# Altium project MCU103A.PrjPcb (part 1 of 4)
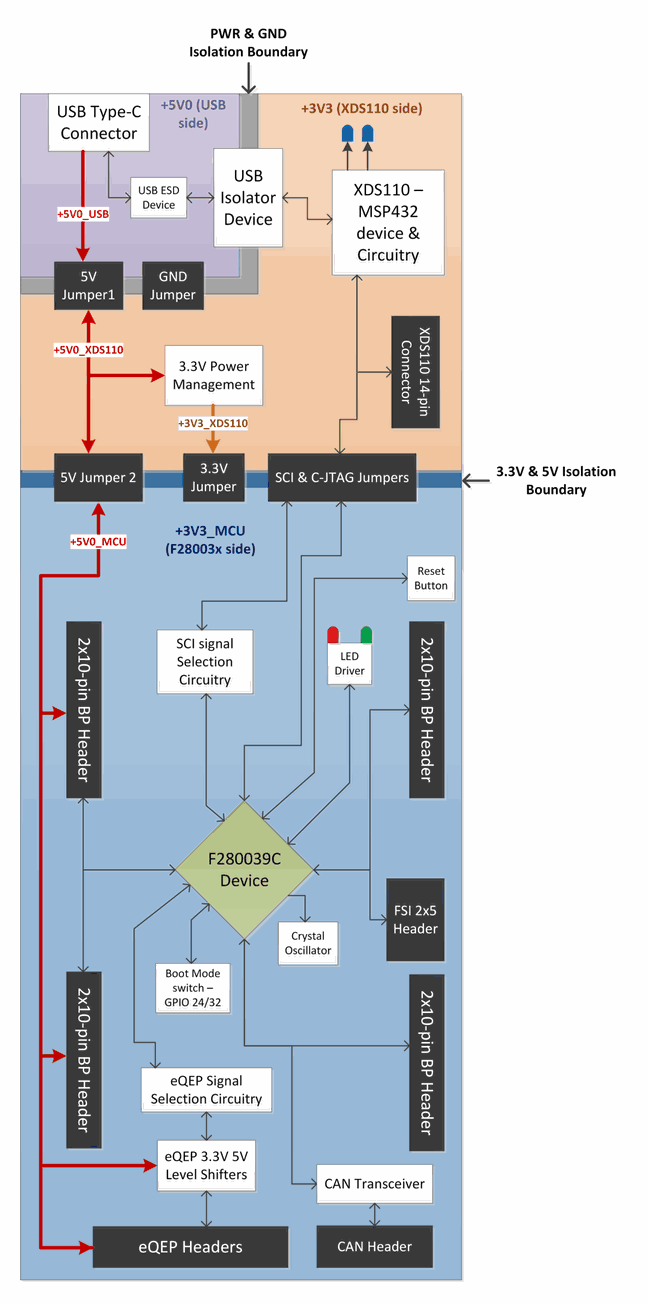
[diagram p0: MCU103A_Block_Diagram.SchDoc]
CopyrightYear: 2021; EVM_orderable: LAUNCHXL-F280039C; PCB_Layout: a0232540; PCB_Rev: A; PRJ_Customer: Public Release; PRJ_Engineer: Kevin Allen; PRJ_Number: MCU103; PRJ_Title: LAUNCHXL-F280039C; SCH_Rev: A; TechSupport: http://www.ti.com/support; TID: N/A
8 sheets, 257 parts. Net scope: global (net labels, ports and power ports of the same name join across sheets).
Board file: MCU103A.PcbDoc
Sheets:
  MCU103A_Block_Diagram.SchDoc
  MCU103A_Connectors.SchDoc
  MCU103A_AltRouting_Misc.SchDoc
  MCU103A_F280039C_Device.SchDoc
  MCU103A_F2800137_Device.SchDoc
  MCU103A_USB_and_Power.SchDoc
  MCU103A_XDS110_MCU.SchDoc
  MCU103A_Hardware.SchDoc

## Sheet MCU103A_Block_Diagram.SchDoc
size 431 x 279 mm; Date: Not shown in title block; ApprovedBy: Not shown in title block; CheckedBy: Not shown in title block; Author: Not shown in title block; CompanyName: Not shown in title block; Engineer: Not shown in title block; Organization: Not shown in title block; Address1: Not shown in title block; Address2: Not shown in title block; Address3: Not shown in title block; Address4: Not shown in title block; DocumentNumber: 1; Revision: Use project parameter SCH_Rev; SheetNumber: 1; SheetTotal: 8; PageSetup: Record=PageOptions|CenterHorizontal=True|CenterVertical=True|PrintScale=1.00|XCorrection=1.00|YCorrection=1.00|PrintKind=0|BorderSize=5000000|LeftOffset=0|BottomOffset=0|Orientation=2|PaperLength=1000|PaperWidth=1000|Scale=100|PaperSource=15|PrintQuality=600|MediaType=1|DitherType=10|PaperKind=Letter|PrintScaleMode=1; CurrentTime: Not shown in title block; CurrentDate: Not shown in title block; Time: Not shown in title block; DocumentFullPathAndName: Not shown in title block; DocumentName: Not shown in title block; ModifiedDate: Not shown in title block; ImagePath: Not shown in title block

### Notes on the sheet
- Drawn By:
- SVN Rev:
- Number:
- TID #:
- Orderable:
- Rev:
- Sheet Title:
- File:
- Project Title:
- Designed for:
- Assembly Variant:
- Mod. Date:
- Sheet:
- Size:
- of
- B
- http://www.ti.com
- Texas Instruments and/or its licensors do not warrant the accuracy or completeness of this specification or any information contained therein. Texas Instruments and/or its licensors do not warrant that this design will meet the specifications, will be suitable for your application or fit for any particular purpose, or will operate in an implementation. Texas Instruments and/or its licensors do not warrant that the design is production worthy. You should completely validate and test your design implementation to confirm the system functionality for your application.
- Engineer:
- Contact:
- © Texas Instruments

## Sheet MCU103A_Connectors.SchDoc
size 431 x 279 mm; Date: Not shown in title block; ApprovedBy: Not shown in title block; CheckedBy: Not shown in title block; Author: Not shown in title block; CompanyName: Not shown in title block; Engineer: Not shown in title block; Organization: Not shown in title block; Address1: Not shown in title block; Address2: Not shown in title block; Address3: Not shown in title block; Address4: Not shown in title block; DocumentNumber: 2; Revision: Use project parameter SCH_Rev; SheetNumber: 2; SheetTotal: 8; PageSetup: Record=PageOptions|CenterHorizontal=True|CenterVertical=True|PrintScale=1.00|XCorrection=1.00|YCorrection=1.00|PrintKind=0|BorderSize=5000000|LeftOffset=0|BottomOffset=0|Orientation=2|PaperLength=1000|PaperWidth=1000|Scale=100|PaperSource=15|PrintQuality=600|MediaType=1|DitherType=10|PaperKind=Letter|PrintScaleMode=1; CurrentTime: Not shown in title block; CurrentDate: Not shown in title block; Time: Not shown in title block; DocumentFullPathAndName: Not shown in title block; DocumentName: Not shown in title block; ModifiedDate: Not shown in title block; ImagePath: Not shown in title block
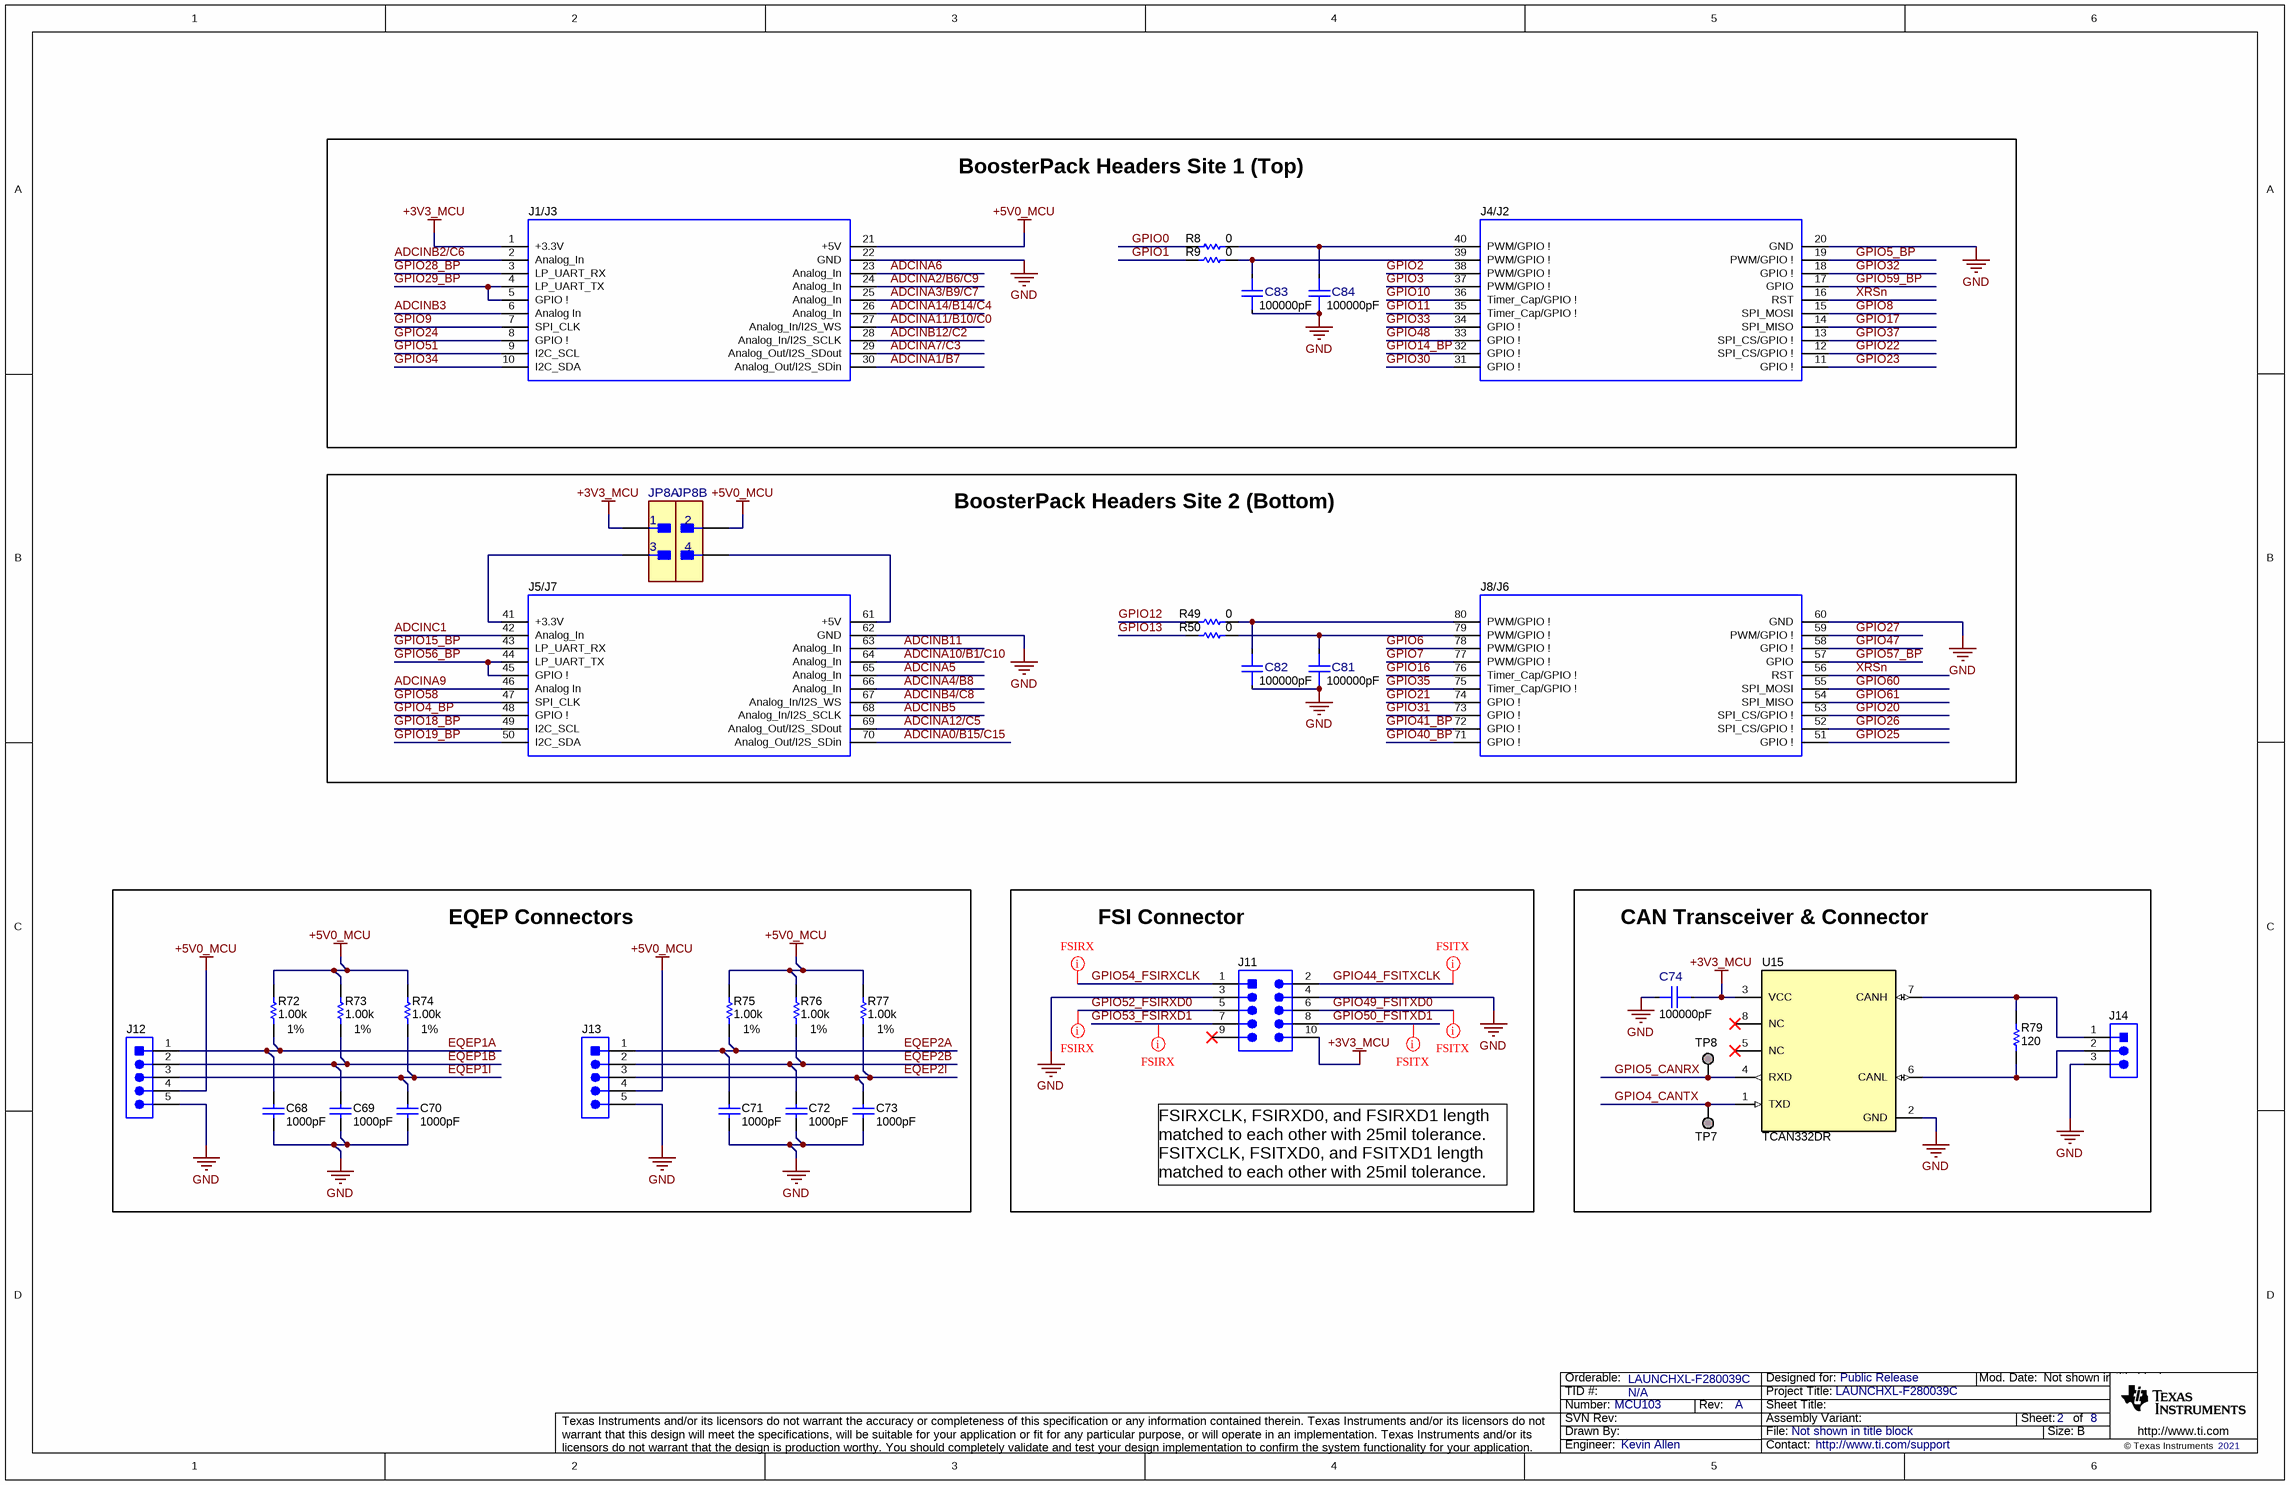
[diagram p1: MCU103A_Connectors.SchDoc]

### Parts
C68  ValueDisplayed: 1000pF  [0402]  (hidden comment: 885012205061)
C69  ValueDisplayed: 1000pF  [0402]  (hidden comment: 885012205061)
C70  ValueDisplayed: 1000pF  [0402]  (hidden comment: 885012205061)
C71  ValueDisplayed: 1000pF  [0402]  (hidden comment: 885012205061)
C72  ValueDisplayed: 1000pF  [0402]  (hidden comment: 885012205061)
C73  ValueDisplayed: 1000pF  [0402]  (hidden comment: 885012205061)
C74  ValueDisplayed: 100000pF  [FP-885012205018_0402-MFG]  (hidden comment: 885012205018)
C81  ValueDisplayed: 100000pF  [FP-885012205018_0402-MFG]  (hidden comment: 885012205018)
C82  ValueDisplayed: 100000pF  [FP-885012205018_0402-MFG]  (hidden comment: 885012205018)
C83  ValueDisplayed: 100000pF  [FP-885012205018_0402-MFG]  (hidden comment: 885012205018)
C84  ValueDisplayed: 100000pF  [FP-885012205018_0402-MFG]  (hidden comment: 885012205018)
J1/J3  SSQ-110-03-T-D  [BoosterPack_40pin_J1J3]  (value not drawn)
J4/J2  SSQ-110-03-T-D  [BoosterPack_40pin_J2J4]  (value not drawn)
J5/J7  SSQ-110-03-T-D  [BoosterPack_40pin_J5J7]  (value not drawn)
J8/J6  SSQ-110-03-T-D  [BoosterPack_40pin_J6J8]  (value not drawn)
J11  61301021121  [WURTH_61301021121]  (value not drawn)
J12  61300511121  [Wurth_61300511121]  (value not drawn)
J13  61300511121  [Wurth_61300511121]  (value not drawn)
J14  61300311121  [WURTH_61300311121]  (value not drawn)
JP8  61300421121  [FP-61300421121_HDR4-MFG]  (value not drawn)  (parts A,B of 2)
R8  ValueDisplayed: 0  [0402]  (hidden comment: RC0402JR-070RL)
R9  ValueDisplayed: 0  [0402]  (hidden comment: RC0402JR-070RL)
R49  ValueDisplayed: 0  [0402]  (hidden comment: RC0402JR-070RL)
R50  ValueDisplayed: 0  [0402]  (hidden comment: RC0402JR-070RL)
R72  ValueDisplayed: 1.00k  Value1: 1%  [0402]  (hidden comment: CRCW04021K00FKED)
R73  ValueDisplayed: 1.00k  Value1: 1%  [0402]  (hidden comment: CRCW04021K00FKED)
R74  ValueDisplayed: 1.00k  Value1: 1%  [0402]  (hidden comment: CRCW04021K00FKED)
R75  ValueDisplayed: 1.00k  Value1: 1%  [0402]  (hidden comment: CRCW04021K00FKED)
R76  ValueDisplayed: 1.00k  Value1: 1%  [0402]  (hidden comment: CRCW04021K00FKED)
R77  ValueDisplayed: 1.00k  Value1: 1%  [0402]  (hidden comment: CRCW04021K00FKED)
R79  ValueDisplayed: 120  [0603]  (hidden comment: RC0603FR-07120RL)
TP7  TESTPOINT  [TP_50MIL-25MILHOLE]  (value not drawn)  (no BOM)
TP8  TESTPOINT  [TP_50MIL-25MILHOLE]  (value not drawn)  (no BOM)
U15  TCAN332DR  [D0008A_N]

### Blocks framed on the sheet
BoosterPack Headers Site 1 (Top): C83 C84 J1/J3 J4/J2 R8 R9
BoosterPack Headers Site 2 (Bottom): C81 C82 J5/J7 J8/J6 JP8 R49 R50
EQEP Connectors: C68-C73 J12 J13 R72-R77
FSI Connector: J11
CAN Transceiver & Connector: C74 J14 R79 TP7 TP8 U15

### Nets
+3V3_MCU: C74.1 J1/J3.1(+3.3V) J11.10 JP8.1 U15.3(VCC)
+5V0_MCU: J1/J3.21(+5V) J12.4 J13.4 JP8.2 R72.2 R73.2 R74.2 R75.2 R76.2 R77.2
GND: C68.2 C69.2 C70.2 C71.2 C72.2 C73.2 C74.2 C81.1 C82.1 C83.1 C84.1 J1/J3.22(GND) J4/J2.20(GND) J5/J7.62(GND) J8/J6.60(GND) J11.3 J11.4 J12.5 J13.5 J14.3 U15.2(GND)
ADCINA0/B15/C15: J5/J7.70(Analog_Out/I2S_SDin)
ADCINA1/B7: J1/J3.30(Analog_Out/I2S_SDin)
ADCINA2/B6/C9: J1/J3.24(Analog_In)
ADCINA3/B9/C7: J1/J3.25(Analog_In)
ADCINA4/B8: J5/J7.66(Analog_In)
ADCINA5: J5/J7.65(Analog_In)
ADCINA6: J1/J3.23(Analog_In)
ADCINA7/C3: J1/J3.29(Analog_Out/I2S_SDout)
ADCINA9: J5/J7.46(Analog_In)
ADCINA10/B1/C10: J5/J7.64(Analog_In)
ADCINA11/B10/C0: J1/J3.27(Analog_In/I2S_WS)
ADCINA12/C5: J5/J7.69(Analog_Out/I2S_SDout)
ADCINA14/B14/C4: J1/J3.26(Analog_In)
ADCINB2/C6: J1/J3.2(Analog_In)
ADCINB3: J1/J3.6(Analog_In)
ADCINB4/C8: J5/J7.67(Analog_In/I2S_WS)
ADCINB5: J5/J7.68(Analog_In/I2S_SCLK)
ADCINB11: J5/J7.63(Analog_In)
ADCINB12/C2: J1/J3.28(Analog_In/I2S_SCLK)
ADCINC1: J5/J7.42(Analog_In)
EQEP1A: C68.1 J12.1 R72.1
EQEP1B: C69.1 J12.2 R73.1
EQEP1I: C70.1 J12.3 R74.1
EQEP2A: C71.1 J13.1 R75.1
EQEP2B: C72.1 J13.2 R76.1
EQEP2I: C73.1 J13.3 R77.1
GPIO0: R8.1
GPIO1: R9.1
GPIO2: J4/J2.38(PWM/GPIO_!)
GPIO3: J4/J2.37(PWM/GPIO_!)
GPIO4_BP: J5/J7.48(GPIO_!)
GPIO4_CANTX: TP7.1 U15.1(TXD)
GPIO5_BP: J4/J2.19(PWM/GPIO_!)
GPIO5_CANRX: TP8.1 U15.4(RXD)
GPIO6: J8/J6.78(PWM/GPIO_!)
GPIO7: J8/J6.77(PWM/GPIO_!)
GPIO8: J4/J2.15(SPI_MOSI)
GPIO9: J1/J3.7(SPI_CLK)
GPIO10: J4/J2.36(Timer_Cap/GPIO_!)
GPIO11: J4/J2.35(Timer_Cap/GPIO_!)
GPIO12: R49.1
GPIO13: R50.1
GPIO14_BP: J4/J2.32(GPIO_!)
GPIO15_BP: J5/J7.43(LP_UART_RX)
GPIO16: J8/J6.76(Timer_Cap/GPIO_!)
GPIO17: J4/J2.14(SPI_MISO)
GPIO18_BP: J5/J7.49(I2C_SCL)
GPIO19_BP: J5/J7.50(I2C_SDA)
GPIO20: J8/J6.53(SPI_CS/GPIO_!)
GPIO21: J8/J6.74(GPIO_!)
GPIO22: J4/J2.12(SPI_CS/GPIO_!)
GPIO23: J4/J2.11(GPIO_!)
GPIO24: J1/J3.8(GPIO_!)
GPIO25: J8/J6.51(GPIO_!)
GPIO26: J8/J6.52(SPI_CS/GPIO_!)
GPIO27: J8/J6.59(PWM/GPIO_!)
GPIO28_BP: J1/J3.3(LP_UART_RX)
GPIO29_BP: J1/J3.4(LP_UART_TX) J1/J3.5(GPIO_!)
GPIO30: J4/J2.31(GPIO_!)
GPIO31: J8/J6.73(GPIO_!)
GPIO32: J4/J2.18(GPIO_!)
GPIO33: J4/J2.34(GPIO_!)
GPIO34: J1/J3.10(I2C_SDA)
GPIO35: J8/J6.75(Timer_Cap/GPIO_!)
GPIO37: J4/J2.13(SPI_CS/GPIO_!)
GPIO40_BP: J8/J6.71(GPIO_!)
GPIO41_BP: J8/J6.72(GPIO_!)
GPIO44_FSITXCLK: J11.2
GPIO47: J8/J6.58(GPIO_!)
GPIO48: J4/J2.33(GPIO_!)
GPIO49_FSITXD0: J11.6
GPIO50_FSITXD1: J11.8
GPIO51: J1/J3.9(I2C_SCL)
GPIO52_FSIRXD0: J11.5
GPIO53_FSIRXD1: J11.7
GPIO54_FSIRXCLK: J11.1
GPIO56_BP: J5/J7.44(LP_UART_TX) J5/J7.45(GPIO_!)
GPIO57_BP: J8/J6.57(GPIO)
GPIO58: J5/J7.47(SPI_CLK)
GPIO59_BP: J4/J2.17(GPIO)
GPIO60: J8/J6.55(SPI_MOSI)
GPIO61: J8/J6.54(SPI_MISO)
XRSn: J4/J2.16(RST) J8/J6.56(RST)
NetC81_2: C81.2 J8/J6.79(PWM/GPIO_!) R50.2
NetC82_2: C82.2 J8/J6.80(PWM/GPIO_!) R49.2
NetC83_2: C83.2 J4/J2.39(PWM/GPIO_!) R9.2
NetC84_2: C84.2 J4/J2.40(PWM/GPIO_!) R8.2
NetJ5/J7_41: J5/J7.41(+3.3V) JP8.3
NetJ5/J7_61: J5/J7.61(+5V) JP8.4
NetJ14_1: J14.1 R79.2 U15.7(CANH)
NetJ14_2: J14.2 R79.1 U15.6(CANL)

Not connected (* = marked no-connect by the designer): J11 9*; U15 5(NC)* 8(NC)*

### Layout directives
net class FSIRX: GPIO52_FSIRXD0, GPIO53_FSIRXD1, GPIO54_FSIRXCLK
net class FSITX: GPIO44_FSITXCLK, GPIO49_FSITXD0, GPIO50_FSITXD1

### Notes on the sheet
- FSIRXCLK, FSIRXD0, and FSIRXD1 length matched to each other with 25mil tolerance.
  FSITXCLK, FSITXD0, and FSITXD1 length matched to each other with 25mil tolerance.
- Drawn By:
- SVN Rev:
- Number:
- TID #:
- Orderable:
- Rev:
- Sheet Title:
- File:
- Project Title:
- Designed for:
- Assembly Variant:
- Mod. Date:
- Sheet:
- Size:
- of
- B
- http://www.ti.com
- Texas Instruments and/or its licensors do not warrant the accuracy or completeness of this specification or any information contained therein. Texas Instruments and/or its licensors do not warrant that this design will meet the specifications, will be suitable for your application or fit for any particular purpose, or will operate in an implementation. Texas Instruments and/or its licensors do not warrant that the design is production worthy. You should completely validate and test your design implementation to confirm the system functionality for your application.
- Engineer:
- Contact:
- © Texas Instruments

### Library data of the parts
C68-C73 = CMP-0006231-2: CAP, CERM, 1000 pF, 50 V, +/- 10%, X7R, 0402; Manufacturer: Wurth Elektronik; Polarized: N; Value: 1000pF; U/M: EA; Cap_F: 1nF; Value1: Unknown; VDC_V: 50V; TaMin_C: -55°C; TaMax_C: 125°C; SizeArea_mm2: 0.5; SizeAreaWB_mm2: 3; SizeX_mm: 1; SizeZ_mm: 0.6; AEC Category: Q200; CompType: Capacitor; PartNumber: 885012205061; PackageReference: 0402; RoHS: Y; Tolerance_%: 10%; Value2: 50V; MountType: SMT; Technology: Ceramic; TempCo: X7R; Cap_Case: 0402; SizeY_mm: 0.5; Published: 2008-06-19; Publisher: Texas Instruments; LatestRevisionDate: 2017-03-09; ComponentLink1Description: Datasheet link; ComponentLink1URL: http://katalog.we-online.de/pbs/datasheet/885012205061.pdf; Supplier 1: Digi-Key; Supplier Part Number 1: 732-7556-1-ND; Supplier 2: Mouser; Supplier Part Number 2: 710-885012205061; AEC Qualified: N; AEC Grade: N/A
C74 C81-C84 = CMP-0090362-1: 0.1µF ±10% 10V Ceramic Capacitor X7R 0402 (1005 Metric); Manufacturer: Wurth Electronics; AEC Qualified: No; Value: 100nF; SizeZ_mm: 0.55mm; TempCo: 15%; RoHS: TRUE; Tolerance_%: 10%; datasheet: https://www.we-online.com/catalog/datasheet/885012205018.pdf; Lead Free: Yes; Operating Temperature Range: -55°C to +125°C; ComponentLink1Description: Datasheet; Digikey Description: CAP CER 0.1UF 10V X7R 0402; Supplier Part Number 1: 732-7513-1-ND; Supplier 2: Mouser; Mouser Part Number: 710-885012205018; Digikey Part Number: 732-7513-1-ND; Temperature Characteristic: X7R; Supplier 1: Digikey; Datasheet Path: datasheets/Cap-885012205018.pdf; ComponentLink1URL: https://www.we-online.com/catalog/datasheet/885012205018.pdf; VDC_V: 10V; Supplier Part Number 2: 710-885012205018; Cap_F: 100nF; PackageReference: 0402; PartNumber: 885012205018; Part Number: 885012205018; helpURL: https://upverter.com/upn/revision/1acbe355db19639d/
J1/J3 = CMP-0003837-4: Receptacle, 2.54mm, 10x2, Tin, TH; Alternate PartNumber: CRD-081413-A-G; Manufacturer: Samtec; Alternate Manufacturer: Major League Electronics; Note: Booster Pack 40 pin J1 and J3; Green_Lifecycle: Active; Green_REACh: Incomplete; Supplier 1: Digi-Key; CompType: Receptacle; PackageReference: 10x2 Receptacle; RoHS: Y; Supplier Part Number 1: SAM1204-10-ND; MountType: TH; PartNumber: SSQ-110-03-T-D; ComponentLink1Description: Datasheet Link; ComponentLink1URL: https://www.samtec.com/ftppub/cpdf/SSQ-1XX-XX-XXX-X-XX-XXX-XX-X-MKT.pdf; Supplier 2: Newark; Supplier Part Number 2: 11P8392; Green_EU RoHS: Passed; Green_EU RoHS-2: Passed
J4/J2 = CMP-0078266-4: Receptacle, 2.54mm, 10x2, Tin, TH; Alternate PartNumber: CRD-081413-A-G; Manufacturer: Samtec; Alternate Manufacturer: Major League Electronics; Note: Booster Pack 40 pin J2 and J4; Green_REACh: Incomplete; Green_Lifecycle: Active; Green_EU RoHS-2: Passed; CompType: Receptacle; Supplier 1: Digi-Key; PackageReference: 10x2 Receptacle; RoHS: Y; Supplier Part Number 1: SAM1204-10-ND; PartNumber: SSQ-110-03-T-D; MountType: TH; ComponentLink1Description: Datasheet Link; Green_EU RoHS: Passed; ComponentLink1URL: https://www.samtec.com/ftppub/cpdf/SSQ-1XX-XX-XXX-X-XX-XXX-XX-X-MKT.pdf; Supplier 2: Newark; Supplier Part Number 2: 11P8392
J5/J7 = CMP-0081070-3: Receptacle, 2.54mm, 10x2, Tin, TH; Alternate PartNumber: CRD-081413-A-G; Manufacturer: Samtec; Alternate Manufacturer: Major League Electronics; Note: Booster Pack 40 pin J5 and J7; Green_REACh: Incomplete; Green_Lifecycle: Active; ComponentLink1URL: https://www.samtec.com/ftppub/cpdf/SSQ-1XX-XX-XXX-X-XX-XXX-XX-X-MKT.pdf; Green_EU RoHS-2: Passed; CompType: Receptacle; Supplier 1: Digi-Key; PackageReference: 10x2 Receptacle; RoHS: Y; Supplier Part Number 1: SAM1204-10-ND; PartNumber: SSQ-110-03-T-D; MountType: TH; ComponentLink1Description: Datasheet Link; Green_EU RoHS: Passed
J8/J6 = CMP-0081071-3: Receptacle, 2.54mm, 10x2, Tin, TH; Alternate PartNumber: CRD-081413-A-G; Manufacturer: Samtec; Alternate Manufacturer: Major League Electronics; Note: Booster Pack 40 pin J6 and J8; Green_REACh: Incomplete; Green_Lifecycle: Active; ComponentLink1URL: https://www.samtec.com/ftppub/cpdf/SSQ-1XX-XX-XXX-X-XX-XXX-XX-X-MKT.pdf; Green_EU RoHS-2: Passed; CompType: Receptacle; Supplier 1: Digi-Key; PackageReference: 10x2 Receptacle; RoHS: Y; Supplier Part Number 1: SAM1204-10-ND; PartNumber: SSQ-110-03-T-D; MountType: TH; ComponentLink1Description: Datasheet Link; Green_EU RoHS: Passed
J11 = CMP-0054806-3: Header, 2.54 mm, 5x2, Gold, TH; Manufacturer: Wurth Elektronik; Green_Lifecycle: Active; Green_REACh: Passed; Cert_UL: Y; Current_A: 3A; Gender: Male; Pitch_mm: 2.54; Row_Count: 2; Shrouded: N; Voltage_V: 250V; ComponentLink1URL: http://katalog.we-online.de/em/datasheet/6130xx21121.pdf; ClassName: Header; Supplier Part Number 2: 16T0631; Supplier 2: Newark; Supplier Part Number 3: 710-61301021121; Supplier 3: Mouser; RoHS: Y; MountType: TH; Green_EU RoHS-2: Incomplete; Supplier 1: Digi-Key; Green_EU RoHS: Passed; PackageReference: Header, 2.54mm, 5x2, TH; CompType: Header; PartNumber: 61301021121; ComponentLink1Description: Datasheet URL; Supplier Part Number 1: 732-2672-ND; ContactFinish: Gold; Orientation: Vertical; PinCount: 10; RowSpacing_mm: 2.54
J12 J13 = CMP-0084909-1: Header, 2.54mm, 5x1, Gold, TH; Manufacturer: Wurth Elektronik; Pitch_mm: 2.54; Gender: Male; Row_Count: 1; Shrouded: N; Current_A: 3A; Voltage_V: 250V; Color: Black; PinCount: 5; ContactFinish: Gold; ComponentLink1URL: https://katalog.we-online.de/em/datasheet/6130xx11121.pdf; ComponentLink1Description: Datasheet URL; CompType: Header; MountType: TH; PartNumber: 61300511121; RoHS: Y; PackageReference: Header, 2.54mm, 5x1, TH; ClassName: Header; Orientation: Vertical
J14 = CMP-0054796-1: Header, 2.54 mm, 3x1, Gold, TH; Manufacturer: Wurth Elektronik; Green_Lifecycle: Active; Green_REACh: Passed; CNHeader: TRUE; CT: FALSE; PartNumber: 61300311121; PackageReference: Header, 2.54mm, 3x1, TH; ClassName: Header; CompType: Header; RoHS: Y; MountType: TH; ComponentLink1Description: Datasheet URL; ComponentLink1URL: http://katalog.we-online.de/em/datasheet/6130xx11121.pdf; Publisher: Texas Instruments; LatestRevisionDate: 26/05/2017; Supplier 1: Digi-Key; Supplier Part Number 1: 732-5316-ND; Supplier 2: Newark; Supplier Part Number 2: 20X0950; Supplier 3: Farnell; Supplier Part Number 3: 356154; Green_EU RoHS: Passed; Green_EU RoHS-2: Incomplete
JP8 = CMP-0092422-1: THT Vertical Pin Header WR-PHD, Pitch 2.54 mm, Dual Row, 4 pins; Manufacturer: Wurth Electronics; DUT-Pitch_mm: 2.54mm; SizeZ_mm: 8.89mm; Voltage_V: 250V; Conn Gender: Male; AEC Qualified: No; Row_Count: 2; ContactFinish: Gold; Conn Orientation: Straight; Current_A: 3A; Supplier Part Number 2: 710-61300421121; Supplier 1: Digikey; Mouser Part Number: 710-61300421121; Operating Temperature Range: -40°C to +105°C; ComponentLink1URL: https://www.we-online.com/catalog/datasheet/61300421121.pdf; Lead Free: Yes; PinCount: 4; Supplier Part Number 1: 732-5294-ND; Part Number: 61300421121; RoHS: TRUE; Digikey Part Number: 732-5294-ND; Is Female: no; Digikey Description: CONN HEADER VERT 4POS 2.54MM; datasheet: https://www.we-online.com/catalog/datasheet/61300421121.pdf; PartNumber: 61300421121; Supplier 2: Mouser; Datasheet Path: datasheets/Conn-61300421121.pdf; PackageReference: HDR4; helpURL: https://upverter.com/upn/revision/de171c811246619e/; ComponentLink1Description: Datasheet
R8 R9 R49 R50 = CMP-0027004-2: RES, 0, 5%, 0.063 W, 0402; Manufacturer: Yageo America; Power_W: 63mW; TempCo: 200 ppm/C; Value_Code: 0000; U/M: EA; Value: 0; EIA_Code: E24; SizeX_mm: 1; SizeY_mm: 0.5; SizeZ_mm: 0.6; Value2: 0.063W; VDC_V: 50V; AEC Category: Q200; Supplier Part Number 2: 603-RC0402JR-070RL; Publisher: Texas Instruments; Supplier 2: Mouser; Supplier Part Number 3: 9232516; Supplier 3: Farnell; Published: 2008-06-26; RoHS: Y; Value1: 5%; MountType: SMT; Supplier 1: Digi-Key; PackageReference: 0402; Tolerance_%: 5%; Res_ohm: 0; SizeArea_mm2: 0.5; CompType: Resistor; LatestRevisionDate: 2017-03-09; PartNumber: RC0402JR-070RL; AEC Qualified: ?; ComponentLink1Description: Datasheet link; Supplier Part Number 1: 311-0.0JRCT-ND; Technology: Thick Film; ComponentLink1URL: http://www.yageo.com/pdf/Pu-RC0402_51_PbFree_L_2.pdf
R72-R77 = CMP-0026071-3: RES, 1.00 k, 1%, 0.063 W, AEC-Q200 Grade 0, 0402; Manufacturer: Vishay-Dale; Value: 1.00k; Res_ohm: 1k; Value_Code: 1k00; Power_W: 63mW; Value2: 0.063W; VDC_V: 50V; TempCo: 100 ppm/C; SizeArea_mm2: 0.5; SizeX_mm: 1; SizeZ_mm: 0.6; EIA_Code: E96; AEC Category: Q200; AEC Qualified: Y; AEC Grade: 0; CompType: Resistor; PartNumber: CRCW04021K00FKED; PackageReference: 0402; RoHS: E; Tolerance_%: 1%; MountType: SMT; Technology: Thick Film; SizeY_mm: 0.5; ComponentLink1Description: Datasheet link; ComponentLink1URL: http://www.vishay.com/docs/20035/dcrcwe3.pdf; Supplier 1: Digi-Key; Supplier Part Number 1: 541-1.00KLCT-ND; Supplier 2: Newark; Supplier Part Number 2: 52K6545; Supplier 3: Mouser; Supplier Part Number 3: 71-CRCW0402-1.0K-E3
R79 = CMP-0022769-3: RES, 120, 1%, 0.1 W, 0603; Manufacturer: Yageo America; Value: 120; Value_Code: 120R; Power_W: 100mW; Value2: 0.1W; VDC_V: 150V; TempCo: 200 ppm/C; SizeArea_mm2: 1.28; SizeX_mm: 1.6; SizeY_mm: 0.8; SizeZ_mm: 1; U/M: EA; AEC Category: Q200; CompType: Resistor; PartNumber: RC0603FR-07120RL; PackageReference: 0603; RoHS: Y; Res_ohm: 120; Tolerance_%: 1%; Value1: 1%; MountType: SMT; Technology: Thick Film; Published: 2008-06-26; Publisher: Texas Instruments; LatestRevisionDate: 2017-03-09; ComponentLink1Description: Datasheet link; ComponentLink1URL: http://www.yageo.com/pdf/Pu-RC0603_51_PbFree_L_2.pdf; Supplier 1: Digi-Key; Supplier Part Number 1: 311-120HRCT-ND; Supplier 2: Mouser; Supplier Part Number 2: 603-RC0603FR-07120RL; Supplier 3: Farnell; Supplier Part Number 3: 9238379; AEC Qualified: ?
TP7 TP8 = CMP-0078143-3: TEST POINT.  No entry in BOM.; CompType: Testpoint; PackageReference: N/A; Manufacturer: N/A; PartNumber: N/A; Library Reference: TESTPOINT
U15 = CMP-0080974-2: 3.3-V CAN Transceivers, D0008A (SOIC-8); Alternate Manufacturer: Texas Instruments; SizeAreaWB_mm2: 56.58; SizeZ_mm: 1.75; SizeX_mm: 4.9; SizeY_mm: 6.2; SizeArea_mm2: 30.38; CompType: IC; AEC Qualified: N; AEC Category: Q200; ComponentLink1URL: http://www.ti.com/lit/ds/symlink/tcan332.pdf; Alternate PartNumber: TCAN332D; PackageDescription: SOIC-8; RoHS: Y; MountType: SMT; ComponentLink2URL: http://www.ti.com/product/tcan332; ComponentLink3Description: Online Datasheet; ComponentLink2Description: Product Folder; Manufacturer: Texas Instruments; ComponentLink3URL: http://www.ti.com/product/tcan332/datasheet; PackageReference: D0008A; PartNumber: TCAN332DR; ComponentLink1Description: Datasheet Link

## Sheet MCU103A_AltRouting_Misc.SchDoc
size 431 x 279 mm; Date: Not shown in title block; ApprovedBy: Not shown in title block; CheckedBy: Not shown in title block; Author: Not shown in title block; CompanyName: Not shown in title block; Engineer: Not shown in title block; Organization: Not shown in title block; Address1: Not shown in title block; Address2: Not shown in title block; Address3: Not shown in title block; Address4: Not shown in title block; DocumentNumber: 3; Revision: Use project parameter SCH_Rev; SheetNumber: 3; SheetTotal: 8; PageSetup: Record=PageOptions|CenterHorizontal=True|CenterVertical=True|PrintScale=1.00|XCorrection=1.00|YCorrection=1.00|PrintKind=0|BorderSize=5000000|LeftOffset=0|BottomOffset=0|Orientation=2|PaperLength=1000|PaperWidth=1000|Scale=100|PaperSource=15|PrintQuality=600|MediaType=1|DitherType=10|PaperKind=Letter|PrintScaleMode=1; CurrentTime: Not shown in title block; CurrentDate: Not shown in title block; Time: Not shown in title block; DocumentFullPathAndName: Not shown in title block; DocumentName: Not shown in title block; ModifiedDate: Not shown in title block; ImagePath: Not shown in title block
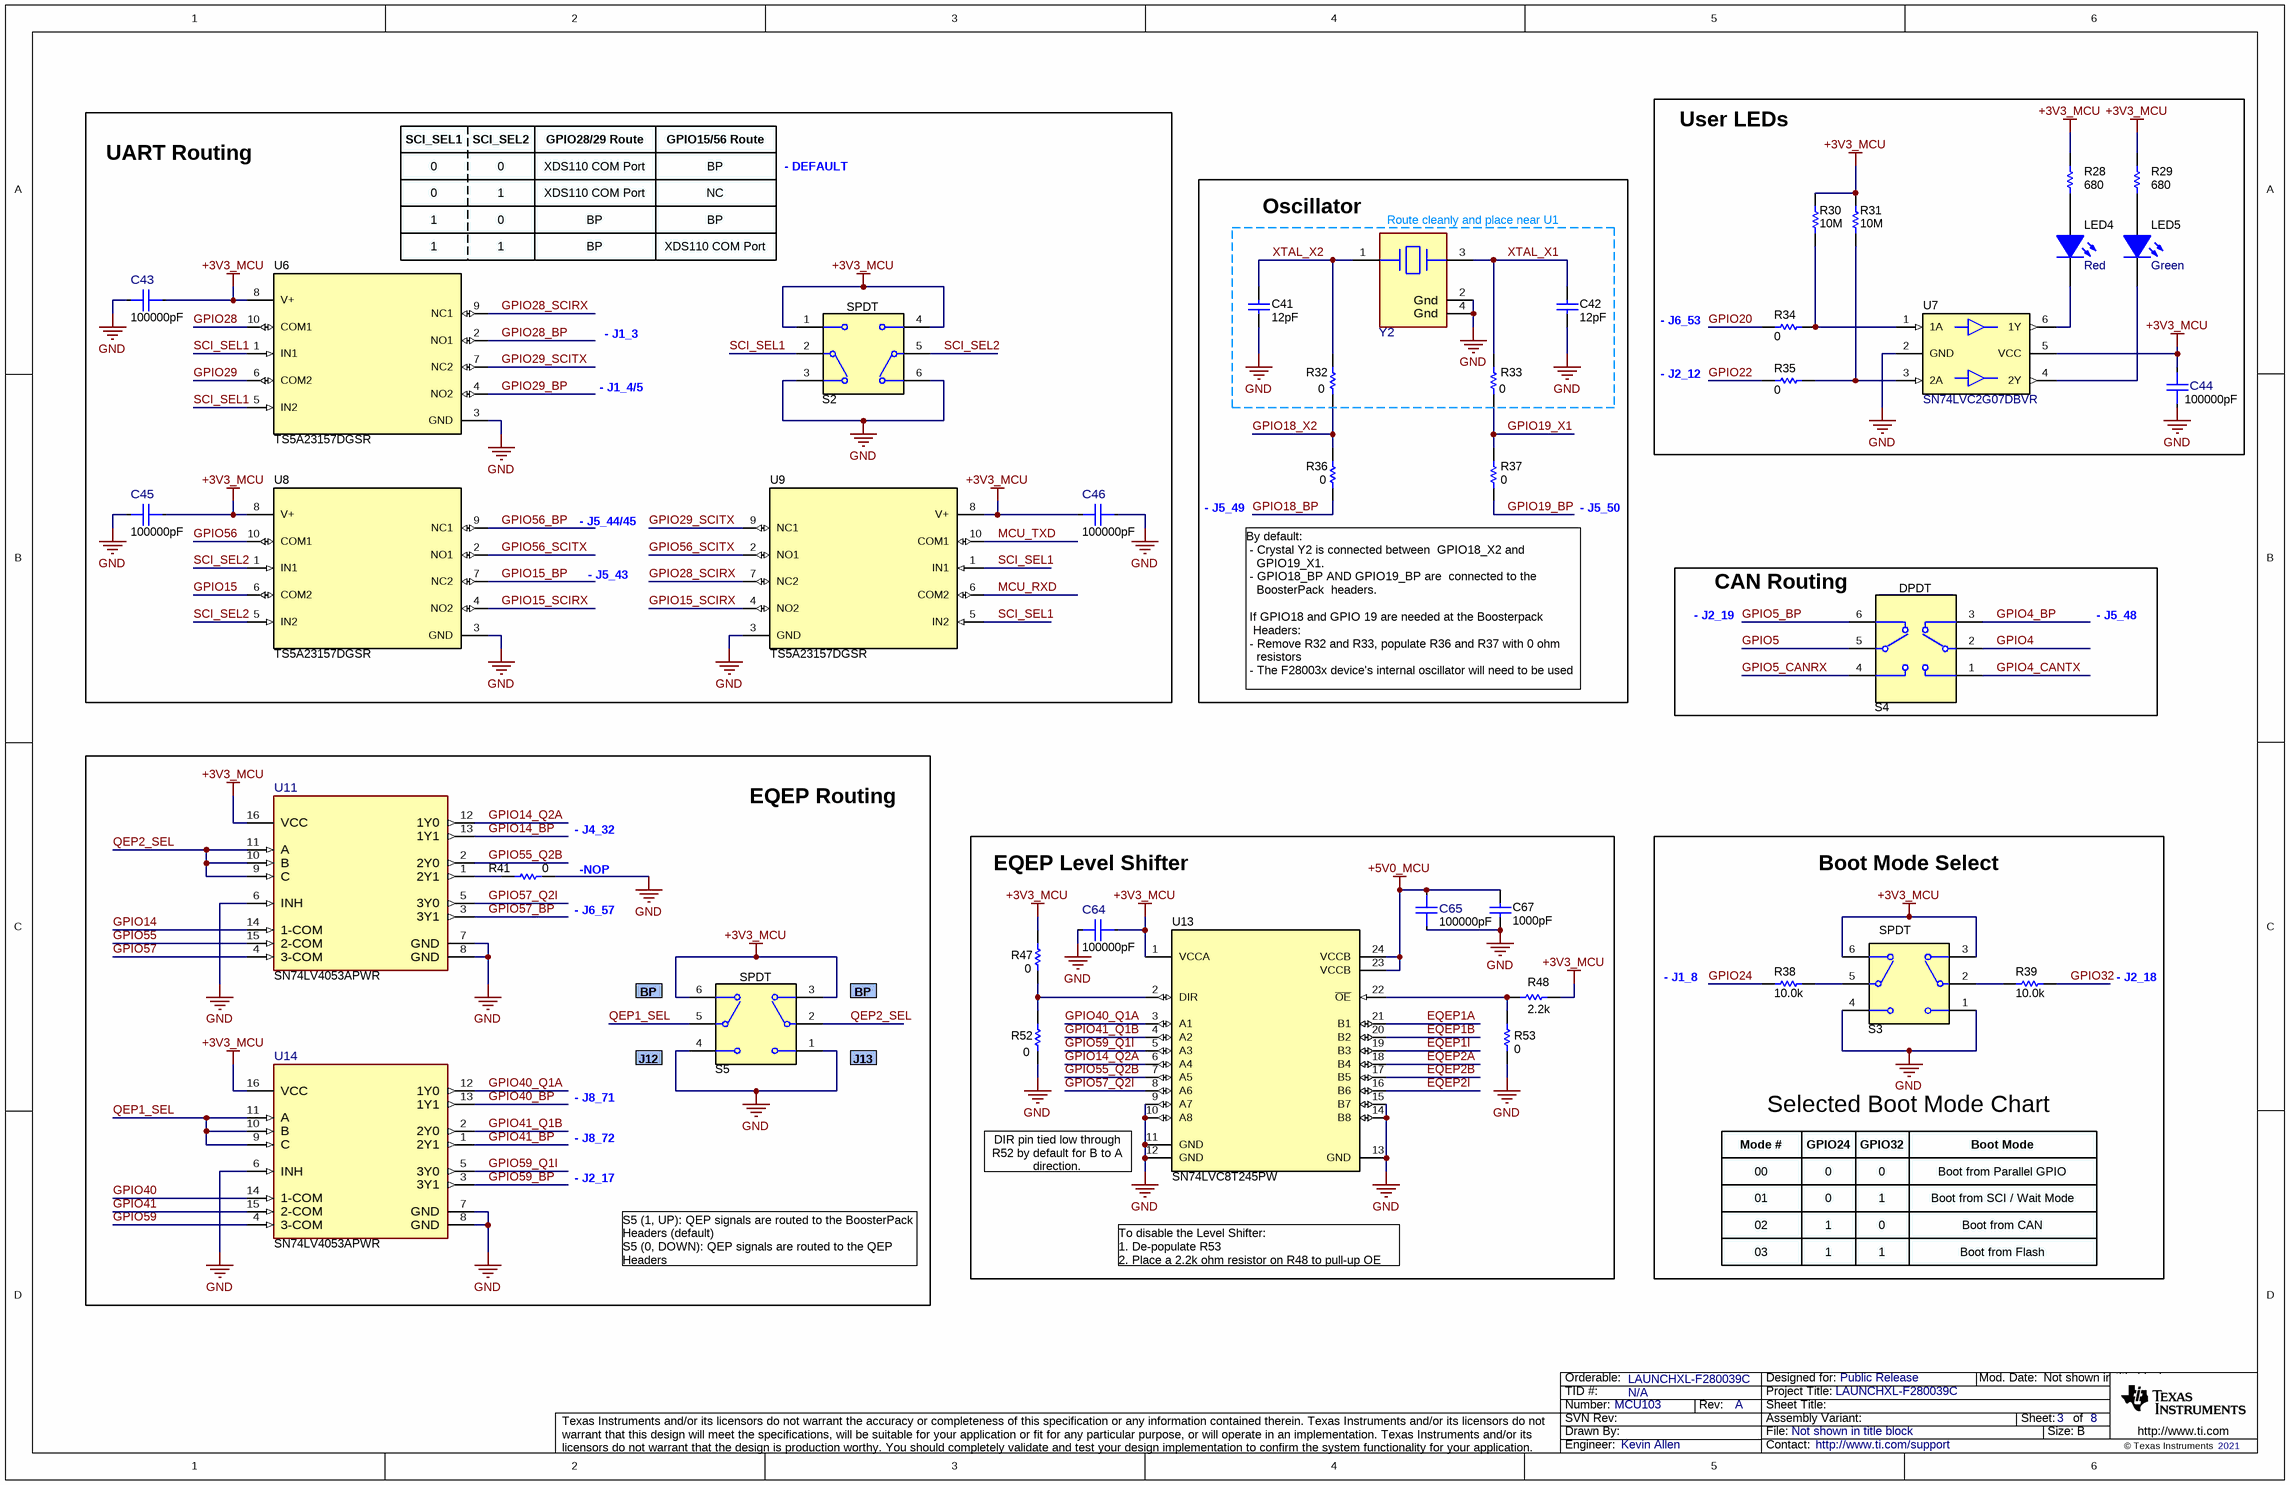
[diagram p2: MCU103A_AltRouting_Misc.SchDoc]

### Parts
C41  ValueDisplayed: 12pF  [0402]  (hidden comment: C0402C120J3GACAUTO)
C42  ValueDisplayed: 12pF  [0402]  (hidden comment: C0402C120J3GACAUTO)
C43  ValueDisplayed: 100000pF  [FP-885012205018_0402-MFG]  (hidden comment: 885012205018)
C44  ValueDisplayed: 100000pF  [FP-885012205018_0402-MFG]  (hidden comment: 885012205018)
C45  ValueDisplayed: 100000pF  [FP-885012205018_0402-MFG]  (hidden comment: 885012205018)
C46  ValueDisplayed: 100000pF  [FP-885012205018_0402-MFG]  (hidden comment: 885012205018)
C64  ValueDisplayed: 100000pF  [FP-885012205018_0402-MFG]  (hidden comment: 885012205018)
C65  ValueDisplayed: 100000pF  [FP-885012205018_0402-MFG]  (hidden comment: 885012205018)
C67  ValueDisplayed: 1000pF  [0402]  (hidden comment: 885012205061)
LED4  value Red  [WL-SMCW_RED_0805]  (hidden comment: 150080SS75000)
LED5  value Green  [LED_LTST-C171]  (hidden comment: LTST-C171GKT)
R28  ValueDisplayed: 680  [0402]  (hidden comment: CRCW0402680RJNED)
R29  ValueDisplayed: 680  [0402]  (hidden comment: CRCW0402680RJNED)
R30  ValueDisplayed: 10M  [0402]  (hidden comment: CRCW040210M0JNED)
R31  ValueDisplayed: 10M  [0402]  (hidden comment: CRCW040210M0JNED)
R32  ValueDisplayed: 0  [0603]  (hidden comment: CRCW06030000Z0EA)
R33  ValueDisplayed: 0  [0603]  (hidden comment: CRCW06030000Z0EA)
R34  ValueDisplayed: 0  [0603]  (hidden comment: CRCW06030000Z0EA)
R35  ValueDisplayed: 0  [0603]  (hidden comment: CRCW06030000Z0EA)
R36  ValueDisplayed: 0  [0603]  (hidden comment: CRCW06030000Z0EA)
R37  ValueDisplayed: 0  [0603]  (hidden comment: CRCW06030000Z0EA)
R38  ValueDisplayed: 10.0k  [0603]  (hidden comment: RC0603FR-0710KL)
R39  ValueDisplayed: 10.0k  [0603]  (hidden comment: RC0603FR-0710KL)
R41  ValueDisplayed: 0  [0603]  (hidden comment: CRCW06030000Z0EA)
R47  ValueDisplayed: 0  [0603]  (hidden comment: CRCW06030000Z0EA)
R48  ValueDisplayed: 2.2k  [0603]  (hidden comment: CRCW06032K20JNEA)
R52  ValueDisplayed: 0  [0603]  (hidden comment: CRCW06030000Z0EA)
R53  ValueDisplayed: 0  [0603]  (hidden comment: CRCW06030000Z0EA)
S2  CAS-D20TA  [SW_CAS-D20TA]  (value not drawn)
S3  CAS-D20TA  [SW_CAS-D20TA]  (value not drawn)
S4  CAS-220TA  [SW_CAS-220TA]  (value not drawn)
S5  CAS-D20TA  [SW_CAS-D20TA]  (value not drawn)
U6  TS5A23157DGSR  [DGS0010A_N]
U7  SN74LVC2G07DBVR  [DBV0006A_N]
U8  TS5A23157DGSR  [DGS0010A_N]
U9  TS5A23157DGSR  [DGS0010A_N]
U11  SN74LV4053APWR  [PW0016A-MFG]
U13  SN74LVC8T245PW  [PW0024A_N]
U14  SN74LV4053APWR  [PW0016A-MFG]
Y2  ECS-200-8-30B-CKM  [FP-ECS-200-8-30B-CKM_SMD4-MFG]  (value not drawn)

### Blocks framed on the sheet
UART Routing: C43 C45 C46 S2 U6 U8 U9
User LEDs: C44 LED4 LED5 R28-R31 R34 R35 U7
Oscillator: C41 C42 R32 R33 R36 R37 Y2
CAN Routing: S4
EQEP Routing: R41 S5 U11 U14
EQEP Level Shifter: C64 C65 C67 R47 R48 R52 R53 U13
Selected Boot Mode Chart: R38 R39 S3

### Nets
+3V3_MCU: C43.1 C44.2 C45.1 C46.2 C64.1 R28.2 R29.2 R30.2 R31.2 R47.2 R48.2 S2.1 S2.4 S3.3 S3.6 S5.3 S5.6 U6.8(V+) U7.5(VCC) U8.8(V+) U9.8(V+) U11.16(VCC) U13.1(VCCA) U14.16(VCC)
+5V0_MCU: C65.2 C67.1 U13.23(VCCB) U13.24(VCCB)
GND: C41.2 C42.2 C43.2 C44.1 C45.2 C46.1 C64.2 C65.1 C67.2 R41.2 R52.1 R53.2 S2.3 S2.6 S3.1 S3.4 S5.1 S5.4 U6.3(GND) U7.2(GND) U8.3(GND) U9.3(GND) U11.6(INH) U11.7(GND) U11.8(GND) U13.9(A7) U13.10(A8) U13.11(GND) U13.12(GND) U13.13(GND) U13.14(B8) U13.15(B7) U14.6(INH) U14.7(GND) U14.8(GND) Y2.2(Gnd) Y2.4(Gnd)
EQEP1A: U13.21(B1)
EQEP1B: U13.20(B2)
EQEP1I: U13.19(B3)
EQEP2A: U13.18(B4)
EQEP2B: U13.17(B5)
EQEP2I: U13.16(B6)
GPIO4: S4.2
GPIO4_BP: S4.3
GPIO4_CANTX: S4.1
GPIO5: S4.5
GPIO5_BP: S4.6
GPIO5_CANRX: S4.4
GPIO14: U11.14(1-COM)
GPIO14_BP: U11.13(1Y1)
GPIO14_Q2A: U11.12(1Y0) U13.6(A4)
GPIO15: U8.6(COM2)
GPIO15_BP: U8.7(NC2)
GPIO15_SCIRX: U8.4(NO2) U9.4(NO2)
GPIO18_BP: R36.1
GPIO18_X2: R32.1 R36.2
GPIO19_BP: R37.1
GPIO19_X1: R33.1 R37.2
GPIO20: R34.1
GPIO22: R35.1
GPIO24: R38.1
GPIO28: U6.10(COM1)
GPIO28_BP: U6.2(NO1)
GPIO28_SCIRX: U6.9(NC1) U9.7(NC2)
GPIO29: U6.6(COM2)
GPIO29_BP: U6.4(NO2)
GPIO29_SCITX: U6.7(NC2) U9.9(NC1)
GPIO32: R39.2
GPIO40: U14.14(1-COM)
GPIO40_BP: U14.13(1Y1)
GPIO40_Q1A: U13.3(A1) U14.12(1Y0)
GPIO41: U14.15(2-COM)
GPIO41_BP: U14.1(2Y1)
GPIO41_Q1B: U13.4(A2) U14.2(2Y0)
GPIO55: U11.15(2-COM)
GPIO55_Q2B: U11.2(2Y0) U13.7(A5)
GPIO56: U8.10(COM1)
GPIO56_BP: U8.9(NC1)
GPIO56_SCITX: U8.2(NO1) U9.2(NO1)
GPIO57: U11.4(3-COM)
GPIO57_BP: U11.3(3Y1)
GPIO57_Q2I: U11.5(3Y0) U13.8(A6)
GPIO59: U14.4(3-COM)
GPIO59_BP: U14.3(3Y1)
GPIO59_Q1I: U13.5(A3) U14.5(3Y0)
MCU_RXD: U9.6(COM2)
MCU_TXD: U9.10(COM1)
QEP1_SEL: S5.5(C) U14.9(C) U14.10(B) U14.11(A)
QEP2_SEL: S5.2(C) U11.9(C) U11.10(B) U11.11(A)
SCI_SEL1: S2.2(C) U6.1(IN1) U6.5(IN2) U9.1(IN1) U9.5(IN2)
SCI_SEL2: S2.5(C) U8.1(IN1) U8.5(IN2)
XTAL_X1: C42.1 R33.2 Y2.3(Out/In)
XTAL_X2: C41.1 R32.2 Y2.1(In/Out)
NetLED4_1: LED4.1(K) U7.6(1Y)
NetLED4_2: LED4.2(A) R28.1
NetLED5_1: LED5.1(A) R29.1
NetLED5_2: LED5.2(K) U7.4(2Y)
NetR30_1: R30.1 R34.2 U7.1(1A)
NetR31_1: R31.1 R35.2 U7.3(2A)
NetR38_2: R38.2 S3.5(C)
NetR39_1: R39.1 S3.2(C)
NetR41_1: R41.1 U11.1(2Y1)
NetR47_1: R47.1 R52.2 U13.2(DIR)
NetR48_1: R48.1 R53.1 U13.22(~{OE})

### Notes on the sheet
- SCI_SEL1
- 0
- SCI_SEL2
- GPIO28/29 Route
- XDS110 COM Port
- GPIO15/56 Route
- BP
- - DEFAULT
- 1
- NC
- (near Y2) Route cleanly and place near U1
- (near U6) 1
- (near S2) SPDT
- - J1_3
- - J6_53
- - J1_4/5
- - J2_12
- - J5_44/45
- - J5_43
- - J5_49
- - J5_50
- - J2_19
- (near S4) DPDT
- - J5_48
- By default:
  - Crystal Y2 is connected between  GPIO18_X2 and
  GPIO19_X1.
  - GPIO18_BP AND GPIO19_BP are  connected to the
  BoosterPack  headers.
  If GPIO18 and GPIO 19 are needed at the Boosterpack
  Headers:
  - Remove R32 and R33, populate R36 and R37 with 0 ohm
  resistors
  - The F28003x device's internal oscillator will need to be used
- (near R41) - J4_32
- (near R41) -NOP
- Boot Mode Select
- (near R41) - J6_57
- (near S5) SPDT
- - J1_8
- (near S3) SPDT
- - J2_18
- - J8_71
- J12
- J13
- - J8_72
- (near U13) DIR pin tied low through R52 by default for B to A direction.
- Mode #
- 00
- GPIO24
- GPIO32
- Boot Mode
- Boot from Parallel GPIO
- - J2_17
- 01
- 02
- Boot from SCI / Wait Mode
- Boot from CAN
- S5 (1, UP): QEP signals are routed to the BoosterPack Headers (default)
  S5 (0, DOWN): QEP signals are routed to the QEP Headers
- To disable the Level Shifter:
  1. De-populate R53
  2. Place a 2.2k ohm resistor on R48 to pull-up OE
- 03
- Boot from Flash
- Drawn By:
- SVN Rev:
- Number:
- TID #:
- Orderable:
- Rev:
- Sheet Title:
- File:
- Project Title:
- Designed for:
- Assembly Variant:
- Mod. Date:
- Sheet:
- Size:
- of
- B
- http://www.ti.com
- Texas Instruments and/or its licensors do not warrant the accuracy or completeness of this specification or any information contained therein. Texas Instruments and/or its licensors do not warrant that this design will meet the specifications, will be suitable for your application or fit for any particular purpose, or will operate in an implementation. Texas Instruments and/or its licensors do not warrant that the design is production worthy. You should completely validate and test your design implementation to confirm the system functionality for your application.
- Engineer:
- Contact:
- © Texas Instruments

### Library data of the parts
C41 C42 = CMP-0006239-2: CAP, CERM, 12 pF, 25 V, +/- 5%, C0G/NP0, AEC-Q200 Grade 1, 0402; Manufacturer: Kemet; TaMin_C: -55°C; Polarized: N; SizeAreaWB_mm2: 3; Value1: Unknown; U/M: EA; Value: 12pF; TaMax_C: 125°C; SizeZ_mm: 0.6; SizeX_mm: 1; SizeY_mm: 0.5; Value2: 25V; AEC Qualified: Y; AEC Category: Q200; Supplier Part Number 2: 86T2558; Publisher: Texas Instruments; Supplier 2: Newark; Supplier Part Number 3: 80-C0402C120J3GAUTO; TempCo: C0G/NP0; Supplier 3: Mouser; Published: 2008-06-19; RoHS: Y; MountType: SMT; Supplier 1: Digi-Key; PackageReference: 0402; Tolerance_%: 5%; Cap_Case: 0402; SizeArea_mm2: 0.5; CompType: Capacitor; LatestRevisionDate: 2017-03-09; PartNumber: C0402C120J3GACAUTO; Cap_F: 12pF; VDC_V: 25V; ComponentLink1Description: Datasheet link; AEC Grade: 1; Supplier Part Number 1: 399-6829-1-ND; Technology: Ceramic; ComponentLink1URL: http://www.kemet.com/Lists/ProductCatalog/Attachments/420/KEM_C1022_C0G_AUTO_SMD.pdf
C43-C46 C64 C65 = CMP-0090362-1: as C74 on sheet MCU103A_Connectors; RoHS: TRUE; Tolerance_%: 10%; datasheet: https://www.we-online.com/catalog/datasheet/885012205018.pdf; Lead Free: Yes; Operating Temperature Range: -55°C to +125°C; ComponentLink1Description: Datasheet; Digikey Description: CAP CER 0.1UF 10V X7R 0402; Supplier Part Number 1: 732-7513-1-ND; Supplier 2: Mouser; Mouser Part Number: 710-885012205018; Digikey Part Number: 732-7513-1-ND; Temperature Characteristic: X7R; Supplier 1: Digikey; Datasheet Path: datasheets/Cap-885012205018.pdf; ComponentLink1URL: https://www.we-online.com/catalog/datasheet/885012205018.pdf; VDC_V: 10V; Supplier Part Number 2: 710-885012205018; Cap_F: 100nF; PackageReference: 0402; PartNumber: 885012205018; Part Number: 885012205018; helpURL: https://upverter.com/upn/revision/1acbe355db19639d/
C67 = CMP-0006231-2: as C68 on sheet MCU103A_Connectors; CompType: Capacitor; PartNumber: 885012205061; PackageReference: 0402; RoHS: Y; Tolerance_%: 10%; Value2: 50V; MountType: SMT; Technology: Ceramic; TempCo: X7R; Cap_Case: 0402; SizeY_mm: 0.5; Published: 2008-06-19; Publisher: Texas Instruments; LatestRevisionDate: 2017-03-09; ComponentLink1Description: Datasheet link; ComponentLink1URL: http://katalog.we-online.de/pbs/datasheet/885012205061.pdf; Supplier 1: Digi-Key; Supplier Part Number 1: 732-7556-1-ND; Supplier 2: Mouser; Supplier Part Number 2: 710-885012205061; AEC Qualified: N; AEC Grade: N/A
LED4 = CMP-0002951-3: LED, Red, SMD; Manufacturer: Wurth Elektronik; Type: AlInGaP; Vf_V: 1.9V; Io_A: 30mA; Vr_V: 5V; Ir_A: 25µA; Tjmax_C: 85°C; Power_TotalModule: 72mW; Value1: 0.072W; Angle: 140; CompType: LED; PartNumber: 150080SS75000; MountType: SMT; RoHS: Y; PackageReference: LED_0805; Value2: 1.9V; Color: Red; ComponentLink1URL: http://katalog.we-online.de/led/datasheet/150080SS75000.pdf; ComponentLink1Description: Datasheet link
LED5 = CMP-0002830-3: LED, Green, SMD; Manufacturer: Lite-On; Type: AlInGaP; Vf_V: 2.1V; Io_A: 20A; Value1: W; SizeAreaWB_mm2: 6.75; SizeArea_mm2: 2.5; SizeX_mm: 2; SizeY_mm: 1.25; SizeZ_mm: 1.2; CompType: LED; PartNumber: LTST-C171GKT; MountType: SMT; RoHS: Y; PackageReference: 0805 LED; Value2: 2.1V; Color: green; ComponentLink1URL: https://sps06.itg.ti.com/sites/KMS/crossdivteams/altium/docs/ComponentDatasheets/LTST-C171GKT.pdf; ComponentLink1Description: Datasheet link
R28 R29 = CMP-0026962-3: RES, 680, 5%, 0.063 W, AEC-Q200 Grade 0, 0402; Manufacturer: Vishay-Dale; Power_W: 63mW; TempCo: 200 ppm/C; Value_Code: 680R; Value: 680; EIA_Code: E24; SizeX_mm: 1; SizeY_mm: 0.5; SizeZ_mm: 0.6; Value2: 0.063W; AEC Qualified: Y; VDC_V: 50V; AEC Category: Q200; AEC Grade: 0; Supplier Part Number 2: 59M6744; Supplier 2: Newark; Supplier Part Number 3: 71-CRCW0402J-680-E3; Supplier 3: Mouser; RoHS: E; Value1: 5%; MountType: SMT; Supplier 1: Digi-Key; PackageReference: 0402; Tolerance_%: 5%; Res_ohm: 680; SizeArea_mm2: 0.5; CompType: Resistor; PartNumber: CRCW0402680RJNED; ComponentLink1Description: Datasheet link; Supplier Part Number 1: 541-680JCT-ND; Technology: Thick Film; ComponentLink1URL: http://www.vishay.com/docs/20035/dcrcwe3.pdf
R30 R31 = CMP-0026826-2: RES, 10 M, 5%, 0.063 W, AEC-Q200 Grade 0, 0402; Manufacturer: Vishay-Dale; Value: 10Meg; Value_Code: 10M0; Power_W: 63mW; Value2: 0.063W; VDC_V: 50V; TempCo: 200 ppm/C; SizeArea_mm2: 0.5; SizeX_mm: 1; SizeZ_mm: 0.6; EIA_Code: E24; AEC Category: Q200; AEC Qualified: Y; AEC Grade: 0; CompType: Resistor; PartNumber: CRCW040210M0JNED; PackageReference: 0402; RoHS: E; Res_ohm: 10M; Tolerance_%: 5%; Value1: 5%; MountType: SMT; Technology: Thick Film; SizeY_mm: 0.5; ComponentLink1Description: Datasheet link; ComponentLink1URL: http://www.vishay.com/docs/20035/dcrcwe3.pdf; Supplier 1: Digi-Key; Supplier Part Number 1: 541-10MJCT-ND; Supplier 2: Newark; Supplier Part Number 2: 59M6697; Supplier 3: Mouser; Supplier Part Number 3: 71-CRCW0402J-10M-E3
R32-R37 R41 R47 R52 R53 = CMP-0025697-4: RES, 0, 5%, 0.1 W, AEC-Q200 Grade 0, 0603; Manufacturer: Vishay-Dale; Value: 0; Value_Code: 0000; Power_W: 100mW; Value2: 0.1W; VDC_V: 75V; TempCo: 200 ppm/C; SizeArea_mm2: 1.28; SizeX_mm: 1.6; SizeY_mm: 0.8; SizeZ_mm: 1; EIA_Code: E24; AEC Category: Q200; AEC Qualified: Y; CompType: Resistor; PartNumber: CRCW06030000Z0EA; PackageReference: 0603; RoHS: E; Res_ohm: 0; Tolerance_%: 5%; Value1: 5%; MountType: SMT; Technology: Thick Film; ComponentLink1Description: Datasheet link; ComponentLink1URL: http://www.vishay.com/docs/20035/dcrcwe3.pdf; Supplier 1: Digi-Key; Supplier Part Number 1: 541-0.0GCT-ND; Supplier 2: Newark; Supplier Part Number 2: 52K8014; Supplier 3: Mouser; Supplier Part Number 3: 71-CRCW0603-0-E3; AEC Grade: 0
R38 R39 = CMP-0022746-5: RES, 10.0 k, 1%, 0.1 W, 0603; Manufacturer: Yageo; Power_W: 100mW; TempCo: 100 ppm/C; Value_Code: 10k0; Value: 10.0k; EIA_Code: E96; Res_ohm: 10k; SizeX_mm: 1.6; SizeY_mm: 0.8; SizeZ_mm: 1; Value2: 0.1W; SizeArea_mm2: 1.28; AEC Qualified: N; VDC_V: 75V; AEC Category: Q200; SizeAreaWB_mm2: 4.68; Supplier Part Number 2: 603-RC0603FR-0710KL; Supplier 2: Mouser; Supplier Part Number 3: 9238603; Supplier 3: Farnell; RoHS: Y; Value1: 1%; MountType: SMT; Supplier 1: Digi-Key; PackageReference: 0603; Tolerance_%: 1%; CompType: Resistor; PartNumber: RC0603FR-0710KL; ComponentLink1Description: Datasheet link; Supplier Part Number 1: 311-10.0KHRCT-ND; Technology: Thick Film; ComponentLink1URL: http://www.yageo.com/pdf/Pu-RC0603_51_PbFree_L_2.pdf; AEC Grade: N/A
R48 = CMP-0025769-4: RES, 2.2 k, 5%, 0.1 W, AEC-Q200 Grade 0, 0603; Manufacturer: Vishay-Dale; Value: 2.2k; Value_Code: 2k20; Power_W: 100mW; Value2: 0.1W; VDC_V: 75V; TempCo: 200 ppm/C; SizeArea_mm2: 1.28; SizeX_mm: 1.6; SizeY_mm: 0.8; SizeZ_mm: 1; EIA_Code: E24; AEC Category: Q200; AEC Qualified: Y; AEC Grade: 0; CompType: Resistor; PartNumber: CRCW06032K20JNEA; PackageReference: 0603; RoHS: E; Res_ohm: 2.2k; Tolerance_%: 5%; Value1: 5%; MountType: SMT; Technology: Thick Film; ComponentLink1Description: Datasheet link; ComponentLink1URL: http://www.vishay.com/docs/20035/dcrcwe3.pdf; Supplier 1: Digi-Key; Supplier Part Number 1: 541-2.2KGCT-ND; Supplier 2: Newark; Supplier Part Number 2: 59M6776; Supplier 3: Farnell; Supplier Part Number 3: 1652868
S2 S5 = CMP-0002233-1: Switch, Dual SPDT,  2 Pos, 0.1A, 6VDC, SMD; Manufacturer: Copal Electronics; VDC_V: 6V; SwitchFunction: On-On; PositionCount: 2; CurrentRating_mA: 100A; PartNumber: CAS-D20TA; MountType: SMT; ComponentLink1Description: Datasheet Link; ComponentLink1URL: http://www.nidec-copal-electronics.com/e/catalog/switch/cas.pdf; RoHS: Y; Circuit: SPDT; Orientation: Top Actuated; CompType: Switch; PackageReference: 5.4x3.9mm; Publisher: Texas Instruments; LatestRevisionDate: 2017-03-09; Supplier 1: Digi-Key; Supplier Part Number 1: CASD20JCT-ND
S3 = CMP-0002233-1: Switch, Dual SPDT,  2 Pos, 0.1A, 6VDC, SMD; Manufacturer: Copal Electronics; CurrentRating_mA: 100A; SwitchFunction: On-On; VDC_V: 6V; PositionCount: 2; ComponentLink1Description: Datasheet Link; LatestRevisionDate: 2017-03-09; PackageReference: 5.4x3.9mm; Publisher: Texas Instruments; Supplier 1: Digi-Key; ComponentLink1URL: http://www.nidec-copal-electronics.com/e/catalog/switch/cas.pdf; Supplier Part Number 1: CASD20JCT-ND; MountType: SMT; Circuit: SPDT; Orientation: Top Actuated; PartNumber: CAS-D20TA; CompType: Switch; RoHS: Y
S4 = CMP-0002123-2: SLIDE SWITCH DPDT  .1A, SMT; Manufacturer: Copal Electronics; VDC_V: 6V; SwitchFunction: On-On; PositionCount: 2; CurrentRating_mA: 100A; PartNumber: CAS-220TA; MountType: SMT; ComponentLink1Description: Datasheet URL; ComponentLink1URL: http://copal-electronics.info/en/0008e/02462.pdf; RoHS: Y; Circuit: DPDT; Orientation: Horizontal; CompType: Switch; PackageReference: SWITCH, 5.4x2.5x3.9mm; Publisher: Texas Instruments; LatestRevisionDate: 2017-03-09; Supplier 1: Digi-Key; Supplier Part Number 1: CAS220JCT-ND
U6 U8 U9 = CMP-0067418-1: DUAL 10-Ohm SPDT ANALOG SWITCH, DGS0010A (VSSOP-10); Alternate PartNumber: TS5A23157DGST; Alternate Manufacturer: Texas Instruments; Green_Lifecycle: Active; SizeAreaWB_mm2: 23.6; Green_REACh: Passed; U/M: EA; SizeZ_mm: 1.1; SizeX_mm: 4.9; SizeY_mm: 3.0; SizeArea_mm2: 14.7; CompType: IC; ComponentLink1URL: http://www.ti.com/lit/ds/symlink/ts5a23157.pdf; Publisher: Texas Instruments; PackageDescription: VSSOP-10; RoHS: Y; Footprint Path 6: C:\AltiumLibraries\Footprints\TI\.PcbLib; MountType: SMT; Green_EU RoHS-2: Passed; Manufacturer: Texas Instruments; Green_EU RoHS: Passed; PackageReference: DGS0010A; LatestRevisionDate: 2017-06-09; PartNumber: TS5A23157DGSR; ComponentLink1Description: Datasheet Link
U7 = CMP-0051789-2: Dual Buffer/Driver with Open-Drain Output, DBV0006A, LARGE T&R; Manufacturer: Texas Instruments; VCC(Min)(V): 1.65; VCC(Max)(V): 5.5; Output Type: CMOS; ICC @ Nom Voltage(Max)(mA): 0.01; Input Type: CMOS/TTL; Bits(#): 2; F @ Nom Voltage(Max)(Mhz): 150; Rating: Catalog; Technology Family: LVC; Voltage(Nom)(V): 1.8,2.5,3.3,5; Schmitt Trigger: No; Output Drive (IOL/IOH)(Max)(mA): 32/-32; tpd @ Nom Voltage(Max)(ns): 8.6,4.4,3.7,2.9; Logic: True; Sub-Family: Inverting Buffer/Driver; AEC Category: Q200; AEC Qualified: N; CompType: IC; Green_Lifecycle: Active; Green_REACh: Passed; SizeArea_mm2: 8.12; SizeAreaWB_mm2: 14.82; SizeX_mm: 2.8; SizeY_mm: 2.9; SizeZ_mm: 1.45; DatasheetVersion: SCES308K; PackageReference: DBV0006A; Generic Part Number: SN74LVC2G07; Operating Temperature Range(C): -40 to 125; 3-State Output: No; ComponentLink1Description: Datasheet Link; ComponentLink1URL: http://www.ti.com/lit/ds/symlink/sn74lvc2g07.pdf; ComponentLink2Description: Product Folder; ComponentLink2URL: http://www.ti.com/product/sn74lvc2g07; ComponentLink3Description: Online Datasheet; ComponentLink3URL: http://www.ti.com/product/sn74lvc2g07/datasheet; Green_EU RoHS-2: Passed; Green_EU RoHS: Passed; MountType: SMT; PackageDescription: SOT-23-6; PartNumber: SN74LVC2G07DBVR; RoHS: Y
U11 U14 = CMP-0089841-1: 3 Circuit IC Switch 2:1 75Ohm 16-TSSOP; Manufacturer: Texas Instruments; TaMax_C: +85°C; Max Supply Voltage: 5.5V; PositionCount: 3; AEC Qualified: No; SizeZ_mm: 1.2mm; Standoff Height: 0.05mm; On State Resistance: 100-225Ω; Min Supply Voltage: 2V; -3Db Bandwith: 50MHz; Nominal Supply Current: 20uA; TaMin_C: -40°C; Lead Free: Yes; Operating Temperature Range: -40°C to +85°C; Mux Demux Ratio: 2:1; ComponentLink1Description: Datasheet; Part Number: SN74LV4053APWR; Digikey Description: IC MUX/DEMUX TRIPLE 2X1 16TSSOP; ComponentLink1URL: https://upverter.com/datasheet/3a9d815208c4051a64f1f6fd539a8c5a24990e71.pdf; PartNumber: SN74LV4053APWR; Mouser Description: Multiplexer Switch ICs Triple 2-Ch Analog; Mouser Part Number: 595-SN74LV4053APWR; RoHS: TRUE; PackageReference: TSSOP16; helpURL: https://upverter.com/upn/revision/43c5e7c12a31b2aa/; datasheet: https://upverter.com/datasheet/3a9d815208c4051a64f1f6fd539a8c5a24990e71.pdf; Digikey Part Number: 296-3833-1-ND; Datasheet Path: datasheets/IC-SN74LV4053APWR.pdf
U13 = CMP-0066458-2: 8-Bit Dual-Supply Bus Transceiver with Configurable Voltage-Level Shifting and Three-State Outputs, PW0024A (TSSOP-24); Alternate Manufacturer: Texas Instruments; SizeAreaWB_mm2: 82.32; SizeZ_mm: 1.2; SizeX_mm: 6.4; SizeY_mm: 7.8; SizeArea_mm2: 49.92; CompType: IC; AEC Category: Q200; AEC Qualified: N; Rating: Catalog; ComponentLink1URL: http://www.ti.com/lit/ds/symlink/sn74lvc8t245.pdf; PackageDescription: TSSOP-24; RoHS: Y; MountType: SMT; Manufacturer: Texas Instruments; PackageReference: PW0024A; PartNumber: SN74LVC8T245PW; ComponentLink1Description: Datasheet Link; ComponentLink2Description: Product Folder; ComponentLink2URL: http://www.ti.com/product/sn74lvc8t245; ComponentLink3Description: Online Datasheet; ComponentLink3URL: http://www.ti.com/product/sn74lvc8t245/datasheet; Operating Temperature Range: -40 to 85 C
Y2 = CMP-0093370-1: 20 MHz ±10ppm Crystal 8pF 40 Ohms 4-SMD, No Lead; Manufacturer: ECS International; Frequency_Fixed: 20MHz; Esr: 40; SizeZ_mm: 0.85mm; Datasheet Path: datasheets/Crys-ECS-200-8-30B-CKM.pdf; ComponentLink1URL: https://ecsxtal.com/store/pdf/ecx_53b.pdf; Supplier Part Number 1: XC1841CT-ND; Operating Temperature Range: -20°C to +70°C; Tolerance_%: 10ppm; PartNumber: ECS-200-8-30B-CKM; PackageReference: SMD4; Mouser Part Number: 520-200-8-30B-CKM; ComponentLink1Description: Datasheet; Part Number: ECS-200-8-30B-CKM; Digikey Description: CRYSTAL 20.0000MHZ 8PF SMD; AEC Qualified: No; Load Capacitance: 8pF; Supplier 2: Mouser; Mouser Description: Crystals 20.000MHZ 8pF 10ppm -20C +70C; Supplier 1: Digikey; Frequency Stability: 10ppm; datasheet: https://ecsxtal.com/store/pdf/ecx_53b.pdf; Frequency Tolerance: 10ppm; Digikey Part Number: XC1841CT-ND; Lead Free: Yes; helpURL: https://upverter.com/upn/revision/b9ae4a09c701963d/; RoHS: TRUE; Series: ECX-53B; Supplier Part Number 2: 520-200-8-30B-CKM